# EAGLE schematic ATmegaProgramming (EAGLE 6.2)
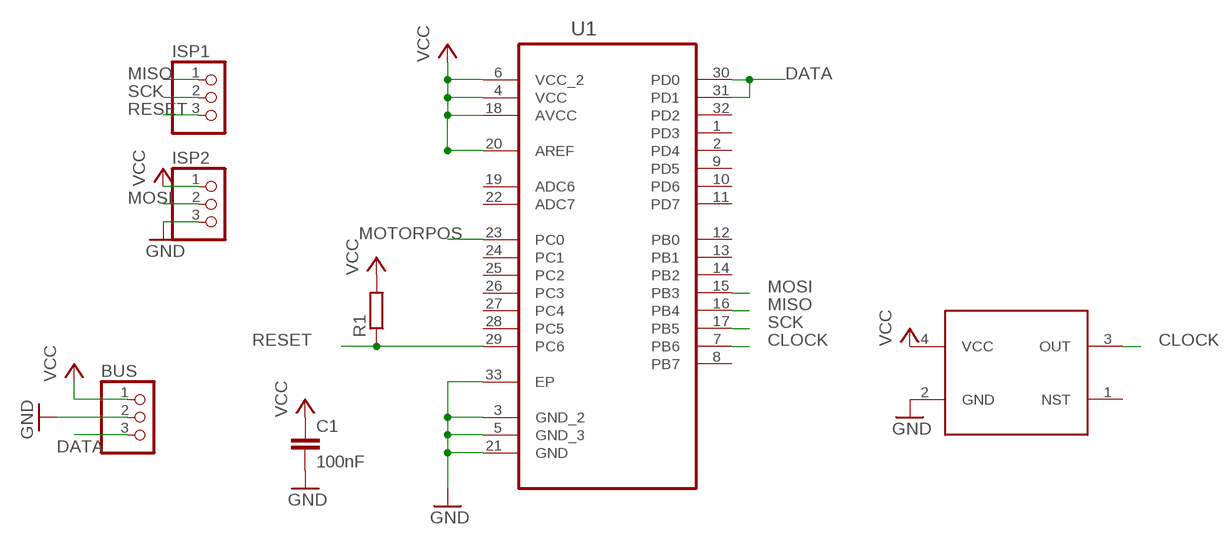
[diagram p0: schematic, sheet 1]

## Parts
BUS  CONNEC_1X03  [CONNEC_1X03]
C1  100nF  C_EU-100NF  [C0805]
ISP1  CONNEC_1X03  [CONNEC_1X03]
ISP2  CONNEC_1X03  [CONNEC_1X03]
R1  RESISTANCE-R0805  [R0805]
RESONATOR  SG-310  [SG-310]
U1  ATMEGA88PA-MU  [QFN50P500X500X100-33N]

## Nets
CLOCK: RESONATOR.3(OUT) U1.7(PB6)
DATA: BUS.3 U1.30(PD0) U1.31(PD1)
GND: BUS.2 C1.2 ISP2.3 RESONATOR.2(GND) U1.3(GND_2) U1.5(GND_3) U1.21(GND) U1.33(EP)
MISO: ISP1.1 U1.16(PB4)
MOSI: ISP2.2 U1.15(PB3)
MOTORPOS: U1.23(PC0)
RESET: ISP1.3 R1.1 U1.29(PC6)
SCK: ISP1.2 U1.17(PB5)
VCC: BUS.1 C1.1 ISP2.1 R1.2 RESONATOR.4(VCC) U1.4(VCC) U1.6(VCC_2) U1.18(AVCC) U1.20(AREF)
Unconnected: RESONATOR.1(NST) U1.1(PD3) U1.2(PD4) U1.8(PB7) U1.9(PD5) U1.10(PD6) U1.11(PD7) U1.12(PB0) U1.13(PB1) U1.14(PB2) U1.19(ADC6) U1.22(ADC7) U1.24(PC1) U1.25(PC2) U1.26(PC3) U1.27(PC4) U1.28(PC5) U1.32(PD2)

## Library data of the parts
BUS ISP1 ISP2 = RobotCampus:CONNEC_1X03
C1 = rhoban:C_EU: non polarised condo; DATASHEET: condo100nF.pdf; FARNELL_LINK: http://fr.farnell.com/kemet/c0805c104j5ractu/condensateur-100nf-50v-x7r-0805/dp/1414663RL
R1 = rhoban:RESISTANCE: RESISTOR, European symbol
RESONATOR = RobotCampus:SG-310
U1 = RobotCampus:ATMEGA88PA-MU: Programmable Flash; MPN: ATMEGA88PA-MU; OC_FARNELL: 1715491; OC_NEWARK: 15R0272; PACKAGE: QFN-32; SUPPLIER: Atmel